# Altium schematic sheet NOT CONNECTED.schdoc
size 502 x 311 mm
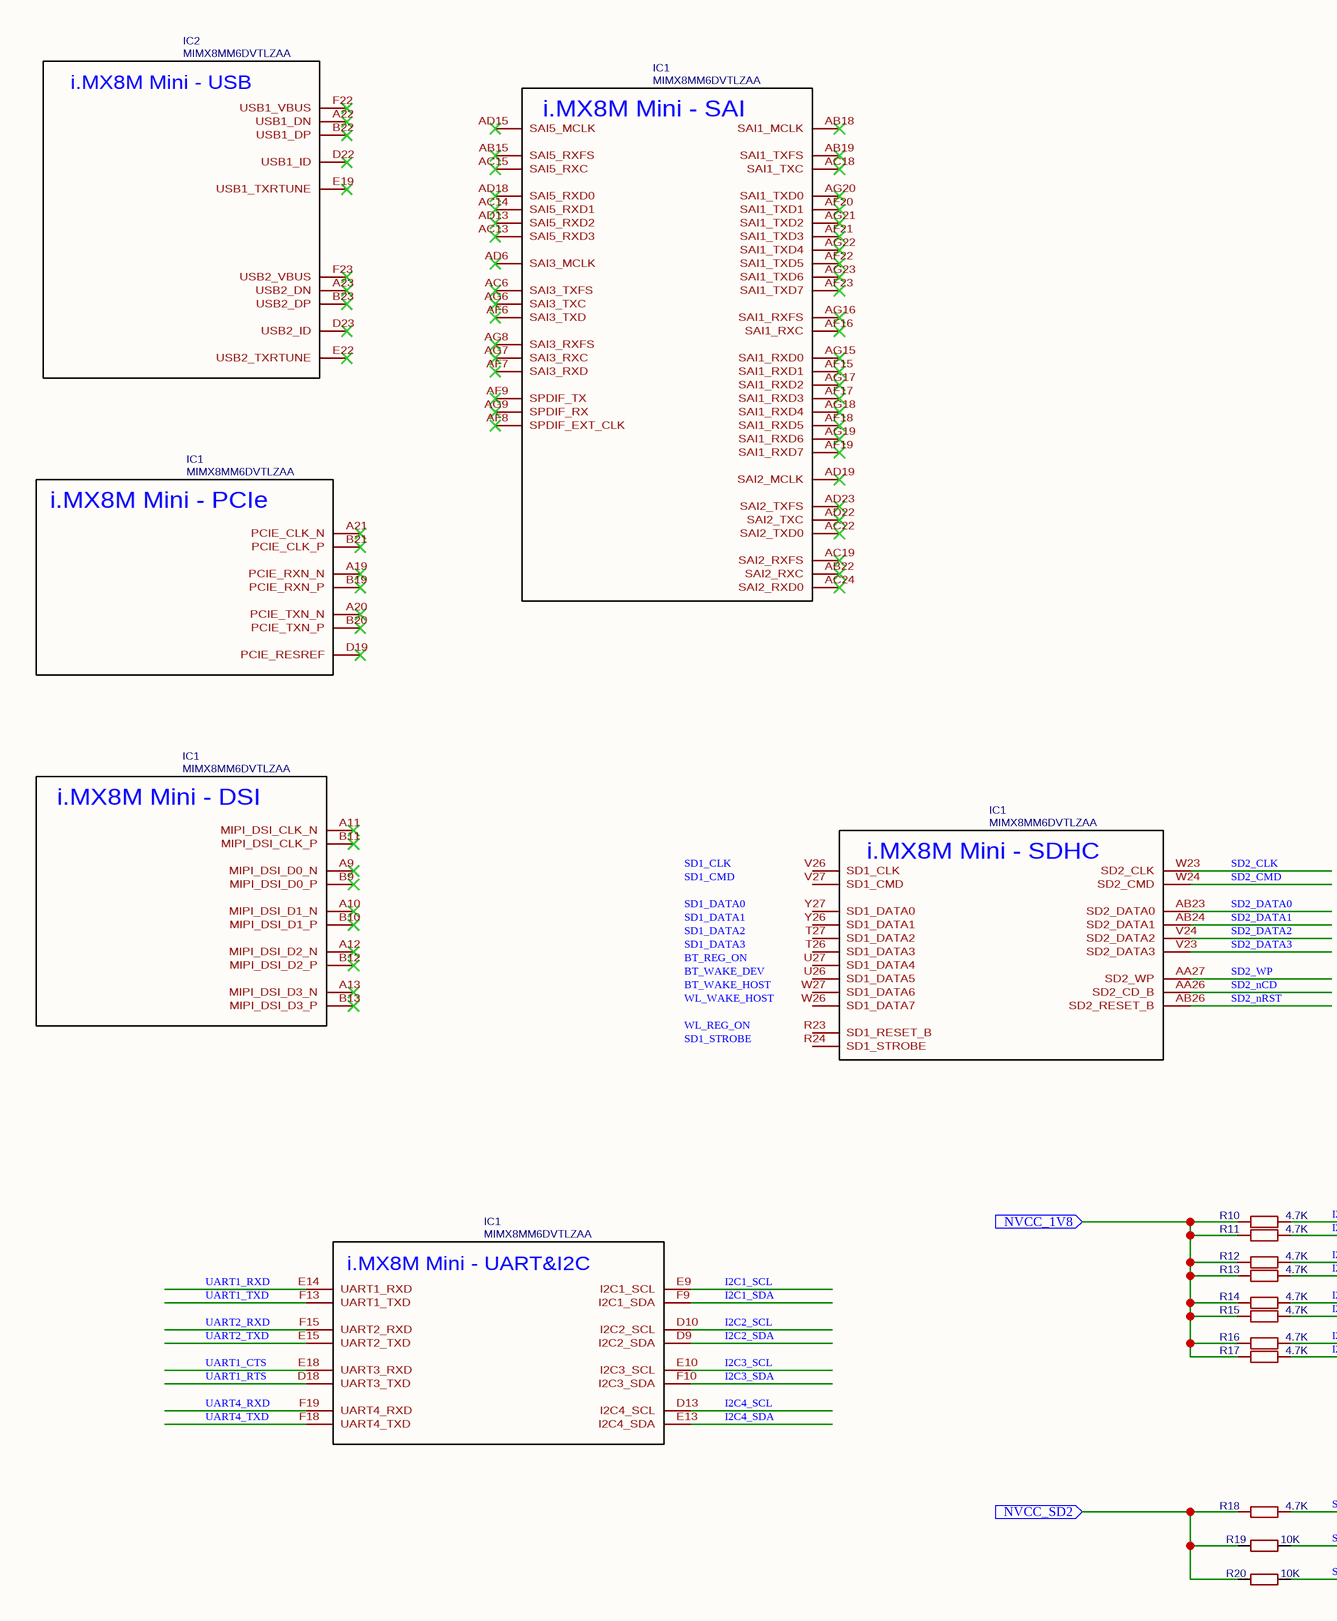
[diagram p0: NOT CONNECTED.schdoc, left]
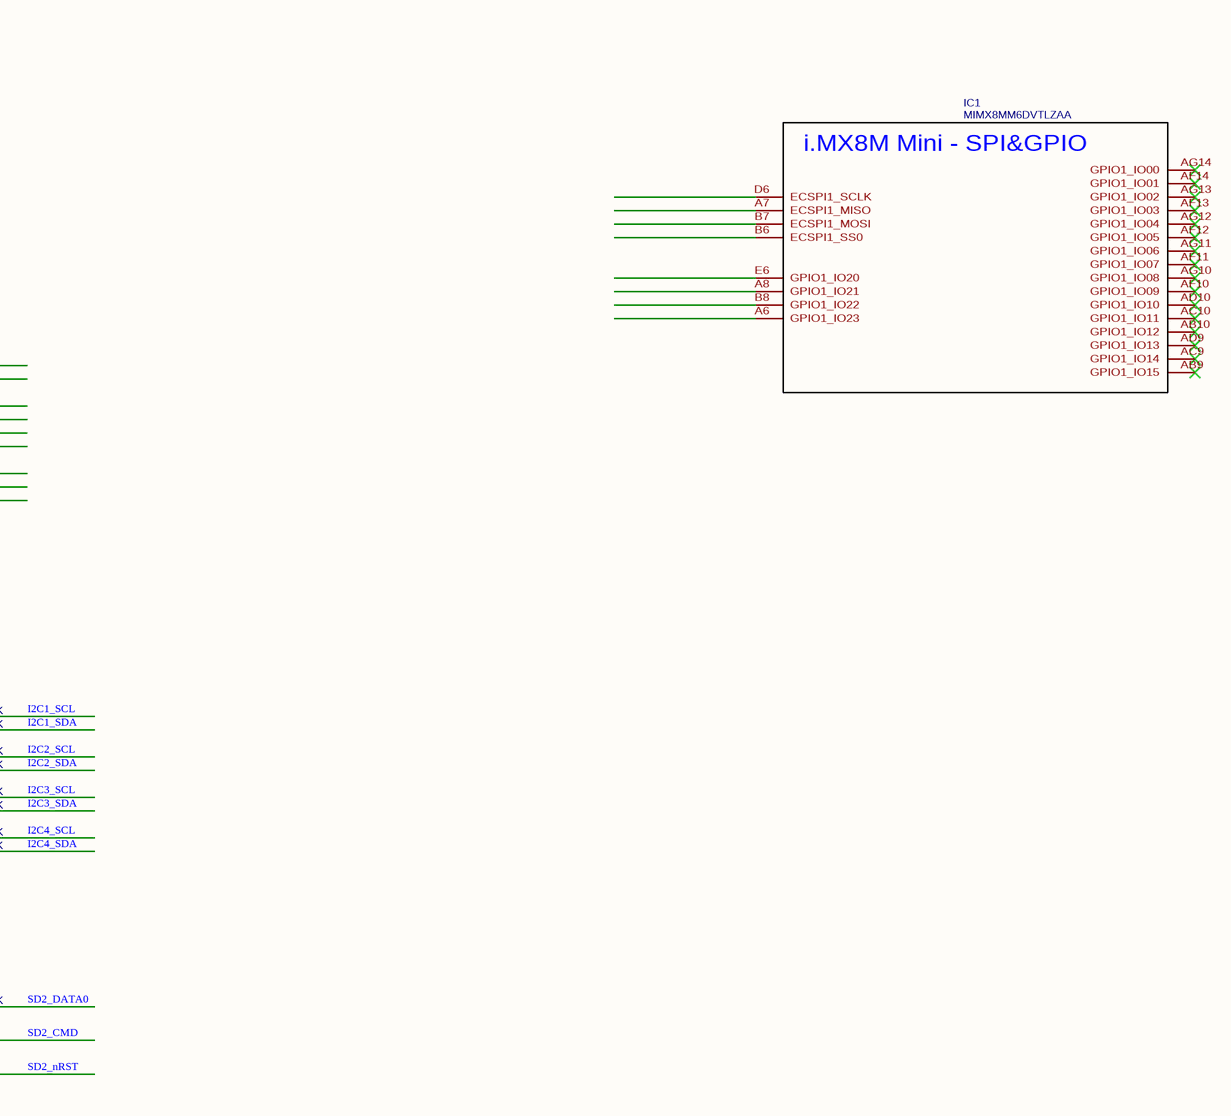
[diagram p1: NOT CONNECTED.schdoc, right]

## Parts
(Parts that share a designator on the sheet are numbered #1, #2 ... from top to bottom, then left to right.)
IC1#1  MIMX8MM6DVTLZAA  [BGA486C50P27X27_1400X1400X125]
IC1#2  MIMX8MM6DVTLZAA  [BGA486C50P27X27_1400X1400X125]
IC1#3  MIMX8MM6DVTLZAA  [BGA486C50P27X27_1400X1400X125]
IC1#4  MIMX8MM6DVTLZAA  [BGA486C50P27X27_1400X1400X125]
IC1#5  MIMX8MM6DVTLZAA  [BGA486C50P27X27_1400X1400X125]
IC1#6  MIMX8MM6DVTLZAA  [BGA486C50P27X27_1400X1400X125]
IC2  MIMX8MM6DVTLZAA  [BGA486C50P27X27_1400X1400X125]
R10  4.7K  [R0402]
R11  4.7K  [R0402]
R12  4.7K  [R0402]
R13  4.7K  [R0402]
R14  4.7K  [R0402]
R15  4.7K  [R0402]
R16  4.7K  [R0402]
R17  4.7K  [R0402]
R18  4.7K  [R0402]
R19  10K  [R0402]
R20  10K  [R0402]

## Ports
NVCC_1V8 (in), NVCC_SD2 (in)

## Nets
I2C1_SCL: IC1#6.E9(I2C1_SCL) R10.2
I2C1_SDA: IC1#6.F9(I2C1_SDA) R11.2
I2C2_SCL: IC1#6.D10(I2C2_SCL) R12.2
I2C2_SDA: IC1#6.D9(I2C2_SDA) R13.2
I2C3_SCL: IC1#6.E10(I2C3_SCL) R14.2
I2C3_SDA: IC1#6.F10(I2C3_SDA) R15.2
I2C4_SCL: IC1#6.D13(I2C4_SCL) R16.2
I2C4_SDA: IC1#6.E13(I2C4_SDA) R17.2
NVCC_1V8: R10.1 R11.1 R12.1 R13.1 R14.1 R15.1 R16.1 R17.1 ; port NVCC_1V8
NVCC_SD2: R18.1 R19.1 R20.1 ; port NVCC_SD2
SD2_CLK: IC1#5.W23(SD2_CLK)
SD2_CMD: IC1#5.W24(SD2_CMD) R19.2
SD2_DATA0: IC1#5.AB23(SD2_DATA0) R18.2
SD2_DATA1: IC1#5.AB24(SD2_DATA1)
SD2_DATA2: IC1#5.V24(SD2_DATA2)
SD2_DATA3: IC1#5.V23(SD2_DATA3)
SD2_nCD: IC1#5.AA26(SD2_CD_B)
SD2_nRST: IC1#5.AB26(SD2_RESET_B) R20.2
SD2_WP: IC1#5.AA27(SD2_WP)
UART1_CTS: IC1#6.E18(UART3_RXD)
UART1_RTS: IC1#6.D18(UART3_TXD)
UART1_RXD: IC1#6.E14(UART1_RXD)
UART1_TXD: IC1#6.F13(UART1_TXD)
UART2_RXD: IC1#6.F15(UART2_RXD)
UART2_TXD: IC1#6.E15(UART2_TXD)
UART4_RXD: IC1#6.F19(UART4_RXD)
UART4_TXD: IC1#6.F18(UART4_TXD)

Not connected (* = marked no-connect by the designer): IC1#1 AB15(SAI5_RXFS)* AB18(SAI1_MCLK)* AB19(SAI1_TXFS)* AB22(SAI2_RXC)* AC6(SAI3_TXFS)* AC13(SAI5_RXD3)* AC14(SAI5_RXD1)* AC15(SAI5_RXC)* AC18(SAI1_TXC)* AC19(SAI2_RXFS)* AC22(SAI2_TXD0)* AC24(SAI2_RXD0)* AD6(SAI3_MCLK)* AD13(SAI5_RXD2)* AD15(SAI5_MCLK)* AD18(SAI5_RXD0)* AD19(SAI2_MCLK)* AD22(SAI2_TXC)* AD23(SAI2_TXFS)* AF6(SAI3_TXD)* AF7(SAI3_RXD)* AF8(SPDIF_EXT_CLK)* AF9(SPDIF_TX)* AF15(SAI1_RXD1)* AF16(SAI1_RXC)* AF17(SAI1_RXD3)* AF18(SAI1_RXD5)* AF19(SAI1_RXD7)* AF20(SAI1_TXD1)* AF21(SAI1_TXD3)* AF22(SAI1_TXD5)* AF23(SAI1_TXD7)* AG6(SAI3_TXC)* AG7(SAI3_RXC)* AG8(SAI3_RXFS)* AG9(SPDIF_RX)* AG15(SAI1_RXD0)* AG16(SAI1_RXFS)* AG17(SAI1_RXD2)* AG18(SAI1_RXD4)* AG19(SAI1_RXD6)* AG20(SAI1_TXD0)* AG21(SAI1_TXD2)* AG22(SAI1_TXD4)* AG23(SAI1_TXD6)*; IC1#2 A19(PCIE_RXN_N)* A20(PCIE_TXN_N)* A21(PCIE_CLK_N)* B19(PCIE_RXN_P)* B20(PCIE_TXN_P)* B21(PCIE_CLK_P)* D19(PCIE_RESREF)*; IC1#3 A6(GPIO1_IO23) A7(ECSPI1_MISO) A8(GPIO1_IO21) AB9(GPIO1_IO15)* AB10(GPIO1_IO12)* AC9(GPIO1_IO14)* AC10(GPIO1_IO11)* AD9(GPIO1_IO13)* AD10(GPIO1_IO10)* AF10(GPIO1_IO09)* AF11(GPIO1_IO07)* AF12(GPIO1_IO05)* AF13(GPIO1_IO03)* AF14(GPIO1_IO01)* AG10(GPIO1_IO08)* AG11(GPIO1_IO06)* AG12(GPIO1_IO04)* AG13(GPIO1_IO02)* AG14(GPIO1_IO00)* B6(ECSPI1_SS0) B7(ECSPI1_MOSI) B8(GPIO1_IO22) D6(ECSPI1_SCLK) E6(GPIO1_IO20); IC1#4 A9(MIPI_DSI_D0_N)* A10(MIPI_DSI_D1_N)* A11(MIPI_DSI_CLK_N)* A12(MIPI_DSI_D2_N)* A13(MIPI_DSI_D3_N)* B9(MIPI_DSI_D0_P)* B10(MIPI_DSI_D1_P)* B11(MIPI_DSI_CLK_P)* B12(MIPI_DSI_D2_P)* B13(MIPI_DSI_D3_P)*; IC1#5 R23(SD1_RESET_B) R24(SD1_STROBE) T26(SD1_DATA3) T27(SD1_DATA2) U26(SD1_DATA5) U27(SD1_DATA4) V26(SD1_CLK) V27(SD1_CMD) W26(SD1_DATA7) W27(SD1_DATA6) Y26(SD1_DATA1) Y27(SD1_DATA0); IC2 A22(USB1_DN)* A23(USB2_DN)* B22(USB1_DP)* B23(USB2_DP)* D22(USB1_ID)* D23(USB2_ID)* E19(USB1_TXRTUNE)* E22(USB2_TXRTUNE)* F22(USB1_VBUS)* F23(USB2_VBUS)*

## Notes on the sheet
- Labels drawn without touching a wire or pin: BT_REG_ON, BT_WAKE_DEV, BT_WAKE_HOST, SD1_CLK, SD1_CMD, SD1_DATA0, SD1_DATA1, SD1_DATA2, SD1_DATA3, SD1_STROBE, WL_REG_ON, WL_WAKE_HOST
- (in symbol MIMX8MM6DVTLZAA) i.MX8M Mini - USB; i.MX8M Mini - PCIe; i.MX8M Mini - DSI; i.MX8M Mini - UART&I2C; i.MX8M Mini - SAI; i.MX8M Mini - SPI&GPIO; i.MX8M Mini - SDHC

## Library data of the parts
IC1#1-IC1#6 IC2 = MIMX8MM6DVTLZAA: subpart_no: 2; Contributor: Ke'Ondrae_Mell; spicePre: I; spiceSymbolName: MIMX8MM6DVTLZAA
R10-R18 = 4.7K: BOM_Manufacturer: Huaxin S&T; BOM_Manufacturer Part: MR04X4701FTL; nameAlias: Resistance (Ohms); Contributor: LCSC; BOM_Supplier: LCSC; BOM_Supplier Part: C327817; spicePre: R; spiceSymbolName: MR04X4701FTL
R19 R20 = 10K: BOM_Manufacturer: UniOhm; BOM_Manufacturer Part: TC0225F1002TCE; nameAlias: Resistance (Ohms); SMT Type: Extend; BOM_Supplier: LCSC; BOM_Supplier Part: C98838; BOM_JLCPCB SMD: Yes; spicePre: R; spiceSymbolName: TC0225F1002TCE